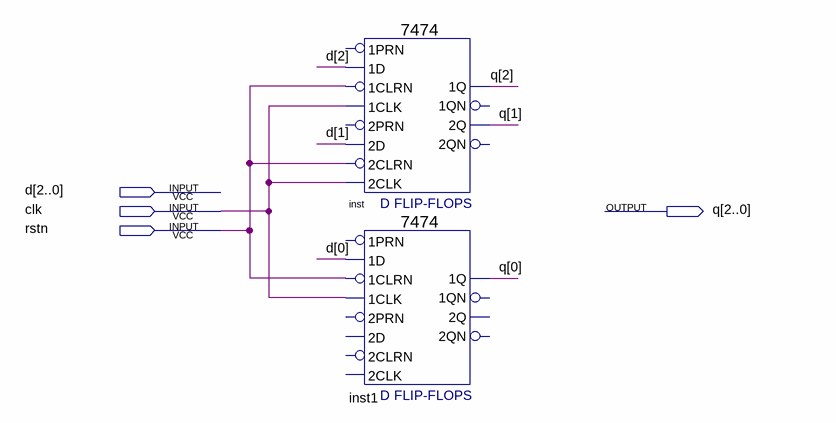
[diagram p0: schematic sheet]
// Quartus schematic reg3.bdf as structural Verilog: 2 symbols, 4 pins
module reg3 (
  input  [2:0] d,
  input  clk,
  input  rstn,
  output [2:0] q
);

  \7474  inst (
    .\2D (d[1]), .\1CLK (clk), .\1D (d[2]), .\2CLK (clk), .\2CLRN (rstn), .\1CLRN (rstn), .\2Q (q[1]),
    .\1Q (q[2]));  // open: 2PRN, 1PRN, 1QN, 2QN
  \7474  inst1 (
    .\1CLK (clk), .\1D (d[0]), .\1CLRN (rstn), .\1Q (q[0]));  // open: 2D, 2PRN, 1PRN, 2CLK, 2CLRN, 1QN, 2Q, 2QN
endmodule
